# EAGLE schematic Motor CC (EAGLE 6.4)
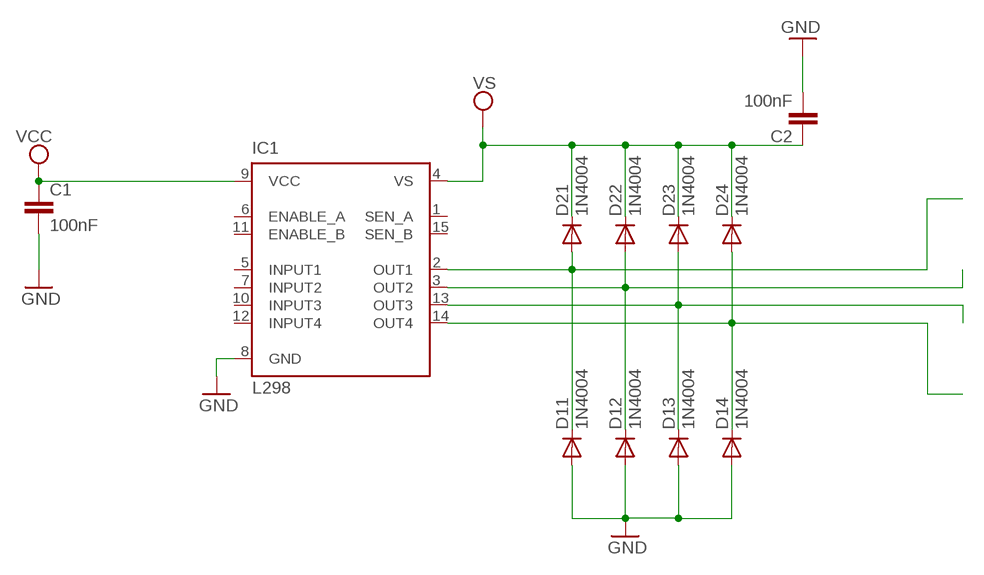
[diagram p0: schematic, sheet 1]

## Parts
C1  100nF  C-EU025-030X050  [C025-030X050]
C2  100nF  C-EU025-030X050  [C025-030X050]
D11  1N4004  [DO41-10]
D12  1N4004  [DO41-10]
D13  1N4004  [DO41-10]
D14  1N4004  [DO41-10]
D21  1N4004  [DO41-10]
D22  1N4004  [DO41-10]
D23  1N4004  [DO41-10]
D24  1N4004  [DO41-10]
IC1  L298  [MULTIWATT-15]

## Nets
GND: C1.2 C2.2 D11.A D12.A D13.A D14.A IC1.8(GND)
N$1: D14.C D24.A IC1.14(OUT4)
N$2: D11.C D21.A IC1.2(OUT1)
N$3: D12.C D22.A IC1.3(OUT2)
N$4: D13.C D23.A IC1.13(OUT3)
VSS: C1.1 C2.1 D21.C D22.C D23.C D24.C IC1.4(VS) IC1.9(VCC) ; supply symbol labelled VS, VCC
Unconnected: IC1.1(SEN_A) IC1.5(INPUT1) IC1.6(ENABLE_A) IC1.7(INPUT2) IC1.10(INPUT3) IC1.11(ENABLE_B) IC1.12(INPUT4) IC1.15(SEN_B)

## Library data of the parts
C1 C2 = resistor:C-EU: CAPACITOR, European symbol
D11-D14 D21-D24 = diode:1N4004: DIODE general purpose rectifier, 1 A
IC1 = st-microelectronics:L298: DUAL FULL-BRIDGE DRIVER; MPN: L298N; OC_FARNELL: 1589425; OC_NEWARK: 32M1527